# EAGLE schematic Shield (EAGLE 7.6.0)
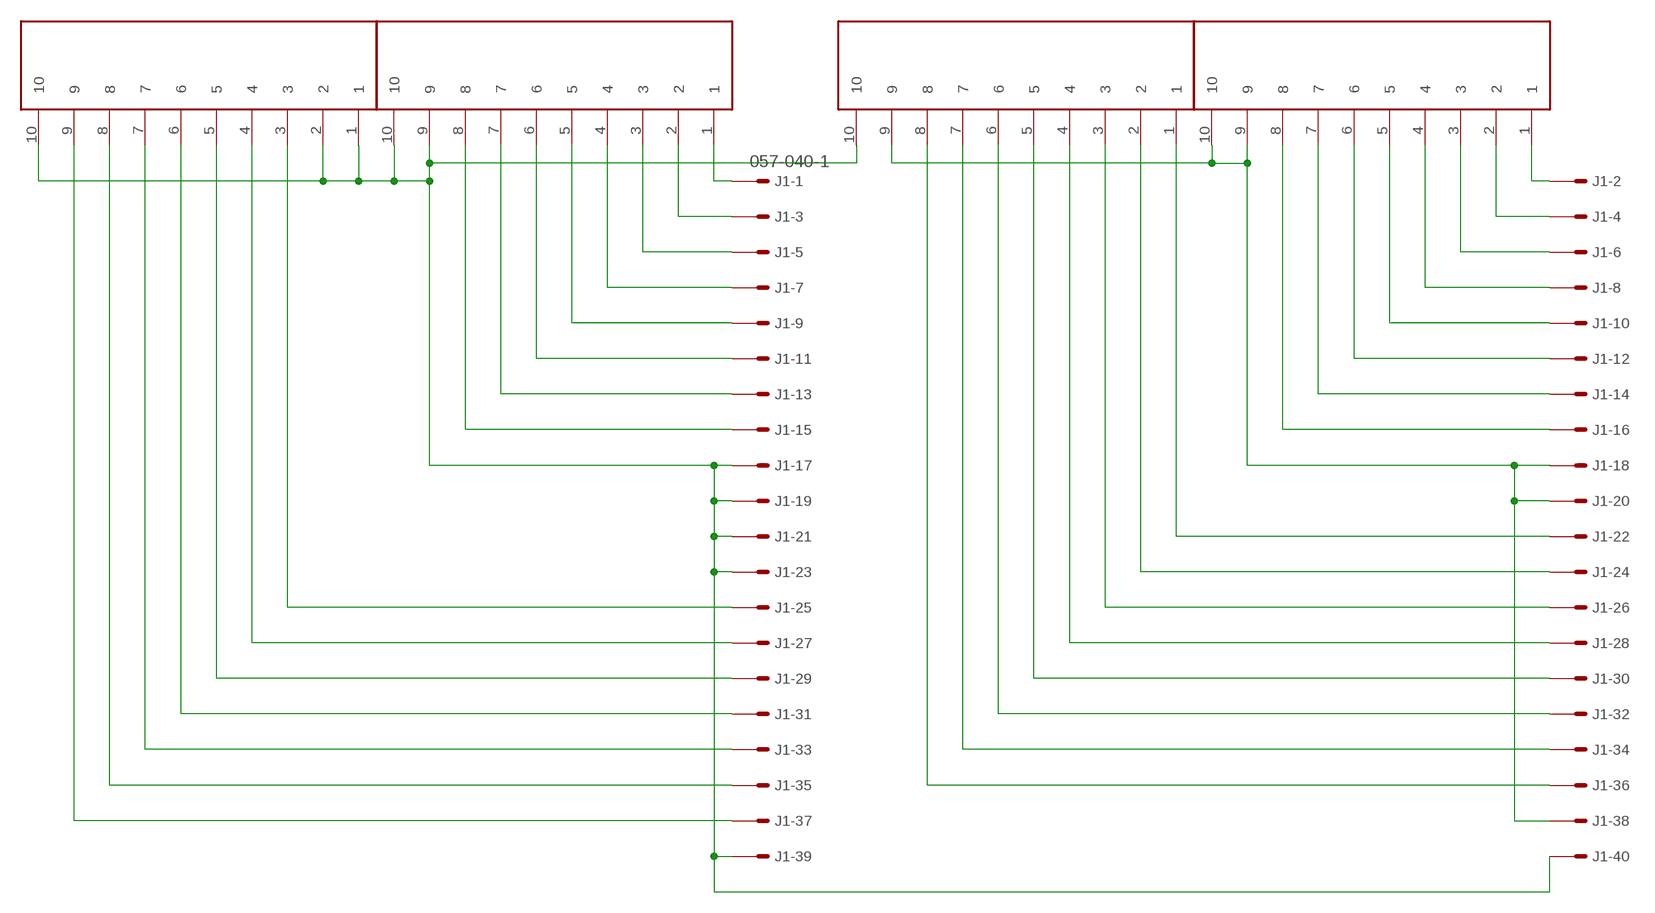
[diagram p0: schematic, sheet 1]

## Parts
J1  057-040-1  [057-040-1]
TB1  282847-10  [282847-10]
TB2  282847-10  [282847-10]
TB3  282847-10  [282847-10]
TB4  282847-10  [282847-10]

## Nets
+12V: J1.18 J1.20 J1.38 TB3.9 TB4.9 TB4.10
GND: J1.17 J1.19 J1.21 J1.23 J1.39 J1.40 TB1.1 TB1.2 TB1.10 TB2.9 TB2.10 TB3.10
N$1: J1.1 TB2.1
N$2: J1.3 TB2.2
N$3: J1.5 TB2.3
N$4: J1.7 TB2.4
N$5: J1.9 TB2.5
N$6: J1.11 TB2.6
N$7: J1.13 TB2.7
N$8: J1.15 TB2.8
N$9: J1.2 TB4.1
N$10: J1.4 TB4.2
N$11: J1.6 TB4.3
N$12: J1.8 TB4.4
N$14: J1.12 TB4.6
N$15: J1.14 TB4.7
N$16: J1.16 TB4.8
N$20: J1.25 TB1.3
N$21: J1.27 TB1.4
N$22: J1.29 TB1.5
N$23: J1.31 TB1.6
N$24: J1.33 TB1.7
N$25: J1.35 TB1.8
N$26: J1.37 TB1.9
N$28: J1.10 TB4.5
N$31: J1.22 TB3.1
N$32: J1.24 TB3.2
N$33: J1.26 TB3.3
N$34: J1.28 TB3.4
N$35: J1.30 TB3.5
N$36: J1.32 TB3.6
N$37: J1.34 TB3.7
N$38: J1.36 TB3.8

## Library data of the parts
J1 = con-panduit-changed:057-040-: CONNECTOR 40-pin series 057 contact pc board low profile headers; OC_FARNELL: unknown; OC_NEWARK: unknown; PARTNO: SBH11-PBPC-D20-ST-BK
TB1-TB4 = TEConnectivity:282847-10; PARTNO: 1-282847-0